# EAGLE design untitled (EAGLE 8.3.1)
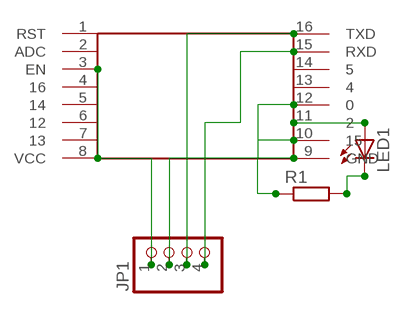
[diagram p0: schematic, sheet 1]

## Parts
JP1  PINHD-1X4  [1X04]
LED1  LED3MM  [LED3MM]
R1  R-EU_0204/2V  [0204V]
U$1  ESP8266-12E  [ESP]

## Nets
N$2: LED1.K(C) R1.2
N$3: LED1.A U$1.11
N$5: JP1.2 R1.1 U$1.9(GND) U$1.10 U$1.12
N$8: JP1.4 U$1.15(RXD)
N$9: JP1.3 U$1.16(TXD)
N$11: JP1.1 U$1.3(EN) U$1.8(VCC)
Unconnected: U$1.1(RST) U$1.2(ADC) U$1.4 U$1.5 U$1.6 U$1.7 U$1.13 U$1.14

## Library data of the parts
JP1 = pinhead:PINHD-1X4: PIN HEADER
LED1 = led:LED: LED OSRAM: - CHIPLED LG R971, LG N971, LY N971, LG Q971, LY Q971, LO R971, LY R971 LH N974, LH R974 LS Q976, LO Q976, LY Q976 LO Q996 - Hyper CHIPLED LW Q18S LB Q993, LB Q99A, LB R99A - SideLED LS A670, LO A670, LY A670, LG A670, LP A670 LB A673, LV A673, LT A673, LW A673 LH A674 LY A675 LS A676, LA A676, LO A676, LY A676, LW A676 LS A679, LY A679, LG A679 - Hyper Micro SIDELED® LS Y876, LA Y876, LO Y876, LY Y876 LT Y87S - SmartLED LW L88C, LW L88S LB L89C, LB L89S, LG L890 LS L89K, LO L89K, LY L89K LS L896, LA L896, LO L896, LY L896 - TOPLED LS T670, LO T670, LY T670, LG T670, LP T670 LSG T670, LSP T670, LSY T670, LOP T670, LYG T670 LG T671, LOG T671, LSG T671 LB T673, LV T673, LT T673, LW T673 LH T674 LS T676, LA T676, LO T676, LY T676, LB T676, LH T676, LSB T676, LW T676 LB T67C, LV T67C, LT T67C, LS T67K, LO T67K, LY T67K, LW E67C LS E67B, LA E67B, LO E67B, LY E67B, LB E67C, LV E67C, LT E67C LW T67C LS T679, LY T679, LG T679 LS T770, LO T770, LY T770, LG T770, LP T770 LB T773, LV T773, LT T773, LW T773 LH T774 LS E675, LA E675, LY E675, LS T675 LS T776, LA T776, LO T776, LY T776, LB T776 LHGB T686 LT T68C, LB T68C - Hyper Mini TOPLED® LB M676 - Mini TOPLED Santana® LG M470 LS M47K, LO M47K, LY M47K Source: http://www.osram.convergy.de LUXEON: - LUMILED® LXK2-PW12-R00, LXK2-PW12-S00, LXK2-PW14-U00, LXK2-PW14-V00 LXK2-PM12-R00, LXK2-PM12-S00, LXK2-PM14-U00 LXK2-PE12-Q00, LXK2-PE12-R00, LXK2-PE12-S00, LXK2-PE14-T00, LXK2-PE14-U00 LXK2-PB12-K00, LXK2-PB12-L00, LXK2-PB12-M00, LXK2-PB14-N00, LXK2-PB14-P00, LXK2-PB14-Q00 LXK2-PR12-L00, LXK2-PR12-M00, LXK2-PR14-Q00, LXK2-PR14-R00 LXK2-PD12-Q00, LXK2-PD12-R00, LXK2-PD12-S00 LXK2-PH12-R00, LXK2-PH12-S00 LXK2-PL12-P00, LXK2-PL12-Q00, LXK2-PL12-R00 Source: www.luxeon.com KINGBRIGHT: KA-3528ASYC Source: www.kingbright.com
R1 = resistor:R-EU_: RESISTOR, European symbol
U$1 = ESP:ESP8266-12E

## Board
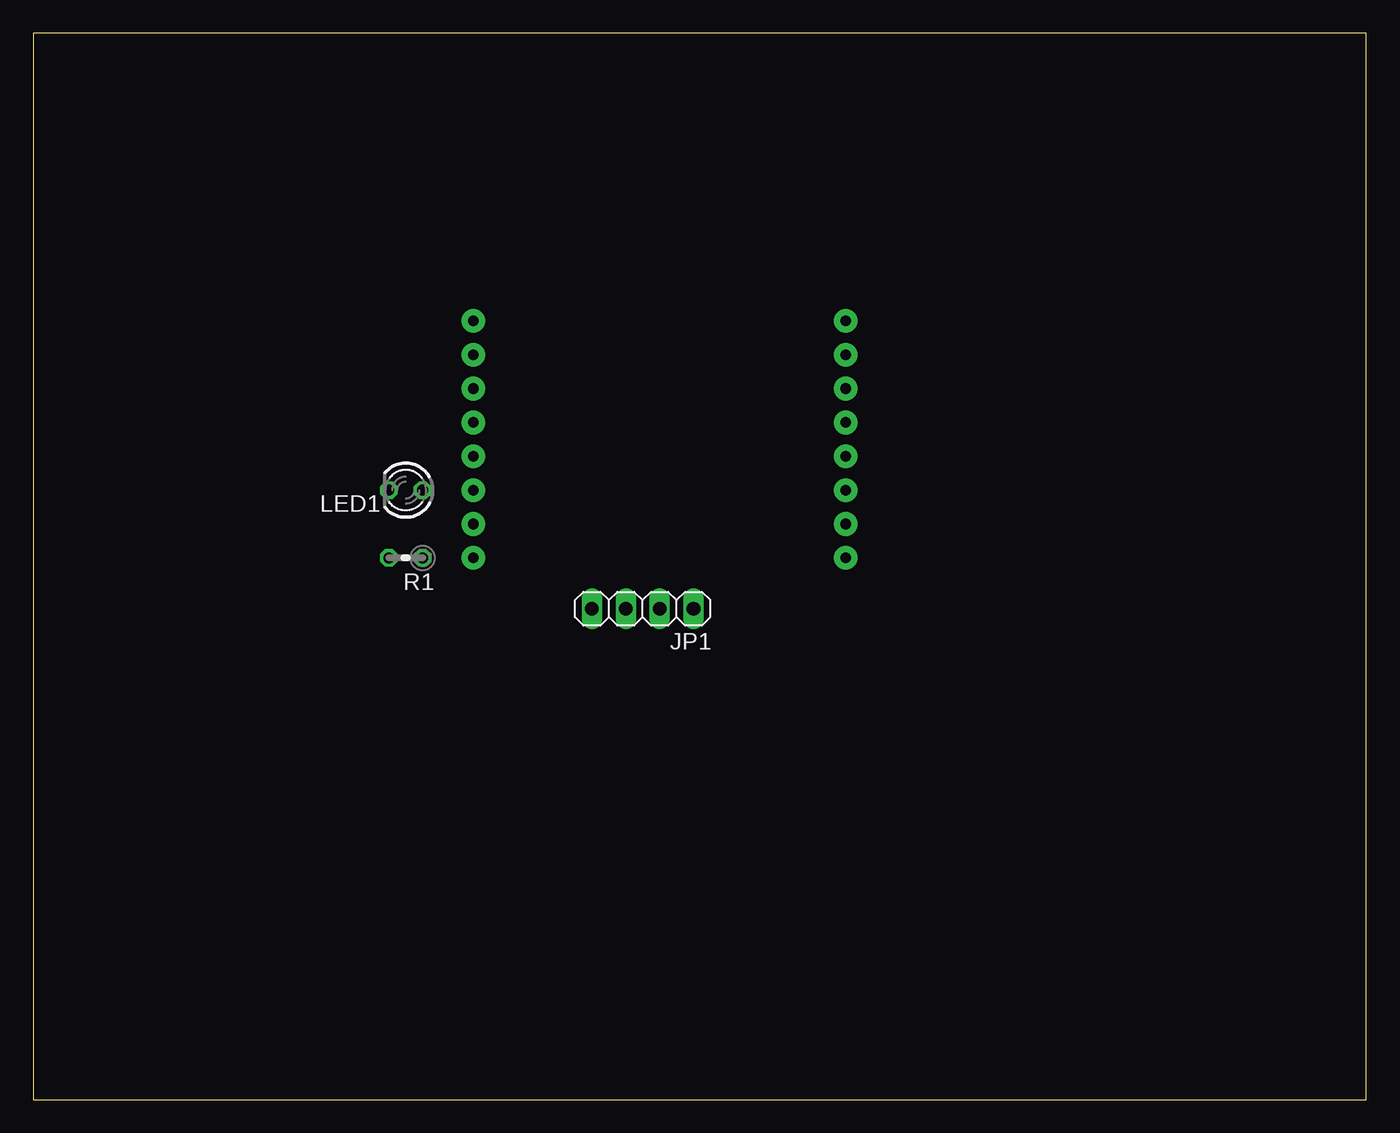
[diagram p1: board, top side]
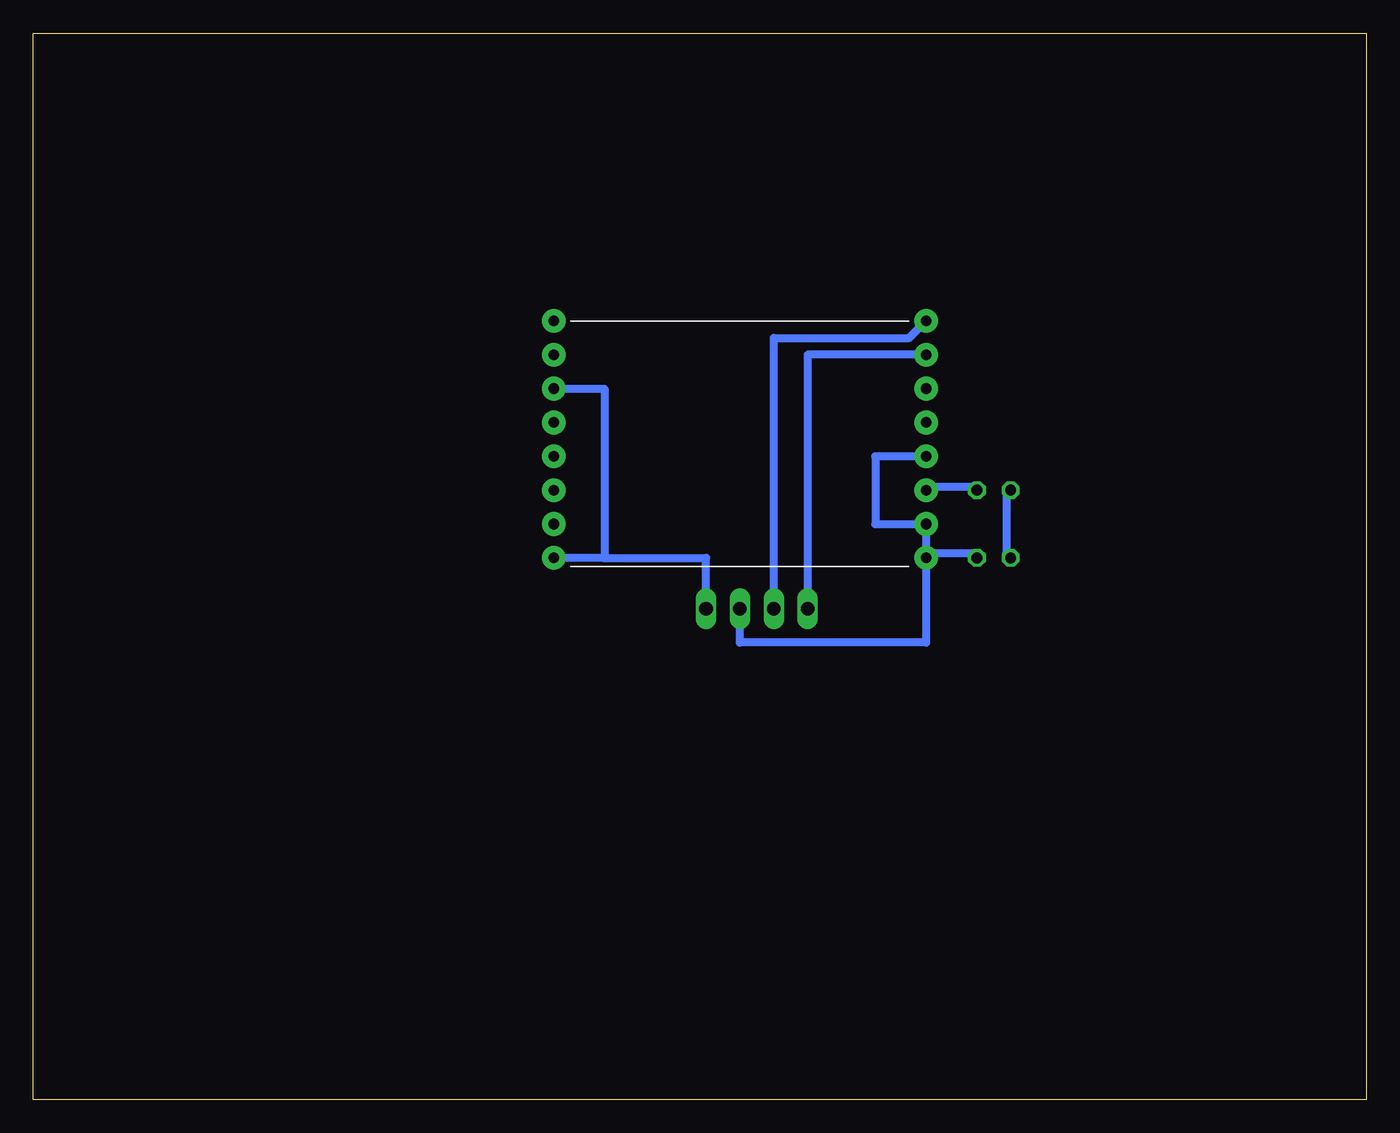
[diagram p2: board, bottom side, seen from below]

Size 100 x 80 mm. Coordinates in mm from the lower left corner, seen from the top.
Outline: 0,0 100,0 100,80 0,80 0,0
Copper layers (1*16): Top 0.035mm / dielectric 1.5mm / Bottom 0.035mm
Design rules "default *": minimum track width 0.6mm, minimum drill 0.35mm, track to track 0.4mm, track to pad 0.4mm, pad to pad 0.4mm, via to via 0.4mm, smd to smd 0.4mm, copper to edge 40mil, drill to drill 6mil, minimum pad ring 10mil, minimum via ring 8mil, stop-mask expansion 4mil, vias tented up to drill 0mil, thermal gap 10mil

### Footprints (pad centres in the part's own frame; a part is rotated, then mirrored left to right if it is on the bottom)
1X04 = drill 1.016 long: 1 -3.81,0; 2 -1.27,0; 3 1.27,0; 4 3.81,0
LED3MM = drill 0.813 octagon: A -1.27,0; K 1.27,0
0204V = drill 0.813 octagon: 1 -1.27,0; 2 1.27,0
ESP = drill 0.8 pad 1.778: 1 0,2.54; 2 0,0; 3 0,-2.54; 4 0,-5.08; 5 0,-7.62; 6 0,-10.16; 7 0,-12.7; 8 0,-15.24; 9 27.94,-15.24; 10 27.94,-12.7; 11 27.94,-10.16; 12 27.94,-7.62; 13 27.94,-5.08; 14 27.94,-2.54; 15 27.94,0; 16 27.94,2.54

### Placement (x,y rotation side)
JP1  45.72,36.83 180 top
LED1  27.94,45.72 180 top
R1  27.94,40.64 180 top
U$1  60.96,55.88 0 bottom

### Tracks (layer width: path | path; a pad name or v marks a point on that pad's centre or on a via)
N$2
  Bottom 0.6: R1.2 27,41 27,45.5 LED1.K
N$3
  Bottom 0.6: LED1.A 29.5,46 33,46 U$1.11
N$5
  Bottom 0.6: 33,41 29.5,41 R1.1 | 46.5,36 46.5,36.5 JP1.2 46.99,34.29 33.02,34.29 U$1.9 | 33.5,40.5 U$1.9 | 33,41 33,43 33.01,43.12 | 33.01,43.12 U$1.10 33.5,43.5 | 33,41 U$1.9 | 33.5,48 U$1.12 36.83,48.26 36.83,43.18 33.07,43.18 33.01,43.12
N$8
  Bottom 0.6: 41.5,37 JP1.4 41.91,55.88 U$1.15 33.5,55.5
N$9
  Bottom 0.6: 44,37 JP1.3 44.45,57.15 34.3,57.15 33.1,58.35 | 33.1,58.35 33.5,58 | 33.1,58.35 U$1.16
N$11
  Bottom 0.6: 50,37 JP1.1 49.53,40.64 57.26,40.64 | U$1.8 60.5,40.5 | 60.5,53 U$1.3 57.15,53.34 57.15,40.75 57.26,40.64 | 60.5,41 U$1.8 | 57.26,40.64 U$1.8